# EAGLE design MM-Qwiic-Carrier-1x1 (EAGLE 9.5.2)
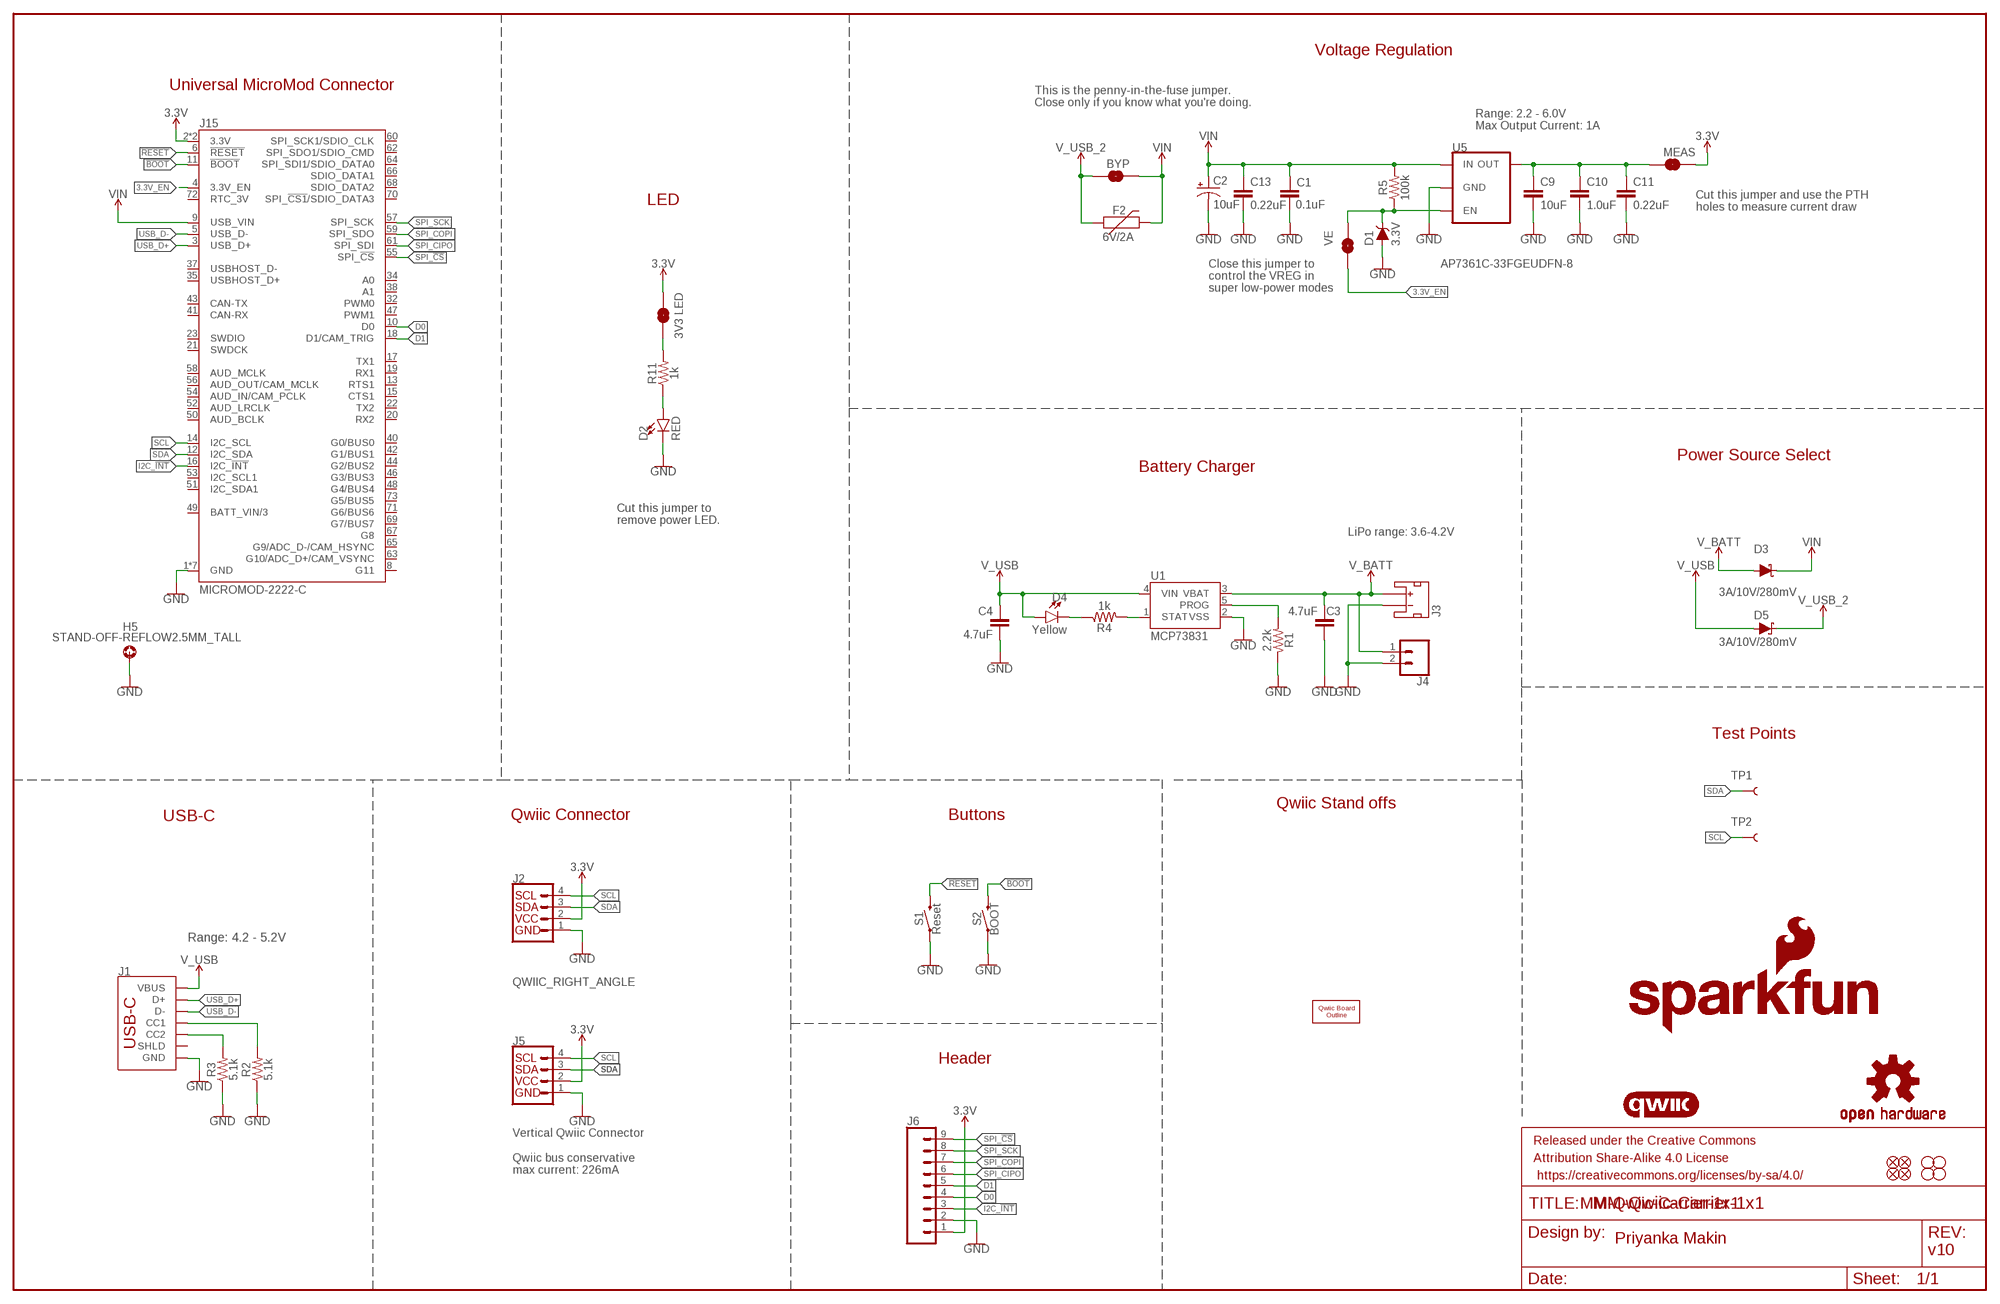
[diagram p0: schematic, sheet 1]

## Parts
BYP  JUMPER-SMT_2_NO_SILK  [SMT-JUMPER_2_NO_SILK]
C1  0.1uF  0.1UF-0603-25V-(+80/-20%)  [0603]
C2  10uF  10UF-POLAR-EIA3216-16V-10%(TANT)  [EIA3216]
C3  4.7uF  4.7UF-0603-35V-(20%)  [0603]
C4  4.7uF  4.7UF-0603-35V-(20%)  [0603]
C9  10uF  10UF-0603-6.3V-20%  [0603]
C10  1.0uF  1.0UF-0603-16V-10%  [0603]
C11  0.22uF  0.22UF-0603-25V-10%  [0603]
C13  0.22uF  0.22UF-0603-25V-10%  [0603]
D1  3.3V  DIODE-ZENER-MM3Z3V3T1G  [SOD-323]
D2  RED  LED-RED0603  [LED-0603]
D3  3A/10V/280mV  DIODE-SCHOTTKY-BAT60A  [SOD-323]
D4  Yellow  LED-YELLOW0603  [LED-0603]
D5  3A/10V/280mV  DIODE-SCHOTTKY-BAT60A  [SOD-323]
F2  6V/2A  PPTC_6V2A  [1210]
FD1  FIDUCIALUFIDUCIAL  [FIDUCIAL-MICRO]
FD2  FIDUCIALUFIDUCIAL  [FIDUCIAL-MICRO]
FD3  FIDUCIALUFIDUCIAL  [FIDUCIAL-MICRO]
FD4  FIDUCIALUFIDUCIAL  [FIDUCIAL-MICRO]
FRAME1  FRAME-LEDGER  [CREATIVE_COMMONS]
H1  STAND-OFF  [STAND-OFF]
H2  STAND-OFF  [STAND-OFF]
H3  STAND-OFF  [STAND-OFF]
H4  STAND-OFF  [STAND-OFF]
H5  STAND-OFF-REFLOW2.5MM_TALL  [STAND-OFF-REFLOW-M2.5]
J1  USB_C_2-LAYER_PADS  [USB-C-16P-2LAYER-PADS]
J2  QWIIC_RIGHT_ANGLE  QWIIC_CONNECTORJS-1MM  [JST04_1MM_RA]
J3  JST_2MM_MALE  [JST-2-SMD]
J4  CONN_021X02_NO_SILK  [1X02_NO_SILK]
J5  Vertical Qwiic Connector  QWIIC_CONNECTOR  [JST04_1MM_VERT]
J6  CONN_09NO_SILK  [1X09_NO_SILK]
J15  MICROMOD-2222-C  [M.2-CONNECTOR-E]
JP4  3V3 LED  JUMPER-SMT_2_NC_TRACE_SILK  [SMT-JUMPER_2_NC_TRACE_SILK]
JP6  VE  JUMPER-SMT_2_NO_SILK  [SMT-JUMPER_2_NO_SILK]
LOGO1  SFE_LOGO_NAME_FLAME.2_INCH  [SFE_LOGO_NAME_FLAME_.2]
LOGO2  QWIIC_LOGO_CONNECTOR  [QWIIC_5.5MM]
LOGO3  OSHW-LOGOM  [OSHW-LOGO-M]
MEAS  JUMPER-COMBO_2_NC_TRACE  [COMBO-JUMPER_2_NC_TRACE]
R1  2.2k  2.2KOHM-0603-1/10W-1%  [0603]
R2  5.1k  5.1KOHM5.1KOHM-0603-1/10W-1%  [0603]
R3  5.1k  5.1KOHM5.1KOHM-0603-1/10W-1%  [0603]
R4  1k  1KOHM-0603-1/10W-1%  [0603]
R5  100k  100KOHM-0603-1/10W-1%  [0603]
R11  1k  1KOHM-0603-1/10W-1%  [0603]
S1  Reset  MOMENTARY-SWITCH-SPST-SMD-5.2-TALL-REDUNDANT  [TACTILE_SWITCH_SMD_5.2MM]
S2  BOOT  MOMENTARY-SWITCH-SPST-SMD-5.2-TALL-REDUNDANT  [TACTILE_SWITCH_SMD_5.2MM]
TP1  TEST-POINT3X5  [PAD.03X.05]
TP2  TEST-POINT3X5  [PAD.03X.05]
U1  MCP73831  [SOT23-5]
U5  AP7361C-33FGEUDFN-8  [UDFN-8]
U$5  QWIIC_BOARD_OUTLINESTANDOFF  [QWIIC_BOARD_MOUNT_SMD_STANDOFFS]

## Nets
3.3V: J2.2 J5.2 J6.1 J15.2(3.3V) J15.74(3.3V) JP4.2 MEAS.2 MEAS.4
3.3V_EN: J15.4(3.3V_EN) JP6.1
!BOOT!: J15.11(!BOOT!) S2.3 S2.4
!RESET!: J15.6(!RESET!) S1.3 S1.4
D0: J6.4 J15.10(D0)
D1: J6.5 J15.18(D1/CAM_TRIG)
GND: C1.2 C2.- C3.2 C4.2 C9.2 C10.2 C11.2 C13.2 D1.A D2.C H5.1 J1.GND J1.GND2(GND) J2.1 J3.1(-) J4.2 J5.1 J6.2 J15.1(GND) J15.7(GND) J15.33(GND) J15.36(GND) J15.39(GND) J15.45(GND) J15.75(GND) R1.1 R2.1 R3.1 S1.1 S1.2 S2.1 S2.2 U1.2(VSS) U5.4(GND) U5.EP(GND)
I2C_!INT!: J6.3 J15.16(I2C_!INT!)
N$1: C9.1 C10.1 C11.1 MEAS.1 MEAS.3 U5.1(OUT)
N$2: R1.2 U1.5(PROG)
N$3: D4.C R4.1
N$4: JP4.1 R11.2
N$6: D2.A R11.1
N$8: R4.2 U1.1(STAT)
N$10: J1.A5(CC1) R2.2
N$11: J1.B5(CC2) R3.2
SCL: J2.4 J5.4 J15.14(I2C_SCL) TP2.P$1
SDA: J2.3 J5.3 J15.12(I2C_SDA) TP1.P$1
SPI_!CS!: J6.9 J15.55(SPI_!CS!)
SPI_CIPO: J6.6 J15.61(SPI_SDI)
SPI_COPI: J6.7 J15.59(SPI_SDO)
SPI_SCK: J6.8 J15.57(SPI_SCK)
USB_D+: J1.A6(D+) J1.B6(D+) J15.3(USB_D+)
USB_D-: J1.A7(D-) J1.B7(D-) J15.5(USB_D-)
V_BATT: C3.1 D3.A J3.2(+) J4.1 U1.3(VBAT)
V_USB: C4.1 D4.A D5.A J1.VBUS1(VBUS) J1.VBUS2(VBUS) U1.4(VIN)
V_USB_2: BYP.1 D5.C F2.1
VIN: BYP.2 C1.1 C2.+ C13.1 D3.C F2.2 J15.9(USB_VIN) R5.2 U5.8(IN)
VREG_EN: D1.C JP6.2 R5.1 U5.5(EN)
Unconnected: J1.SHLD1(SHLD) J1.SHLD2(SHLD) J1.SHLD3(SHLD) J1.SHLD4(SHLD) J3.NC1(PAD1) J3.NC2(PAD2) J15.8(G11) J15.13(RTS1) J15.15(CTS1) J15.17(TX1) J15.19(RX1) J15.20(RX2) J15.21(SWDCK) J15.22(TX2) J15.23(SWDIO) J15.32(PWM0) J15.34(A0) J15.35(USBHOST_D+) J15.37(USBHOST_D-) J15.38(A1) J15.40(G0/BUS0) J15.41(CAN-RX) J15.42(G1/BUS1) J15.43(CAN-TX) J15.44(G2/BUS2) J15.46(G3/BUS3) J15.47(PWM1) J15.48(G4/BUS4) J15.49(BATT_VIN/3) J15.50(AUD_BCLK) J15.51(I2C_SDA1) J15.52(AUD_LRCLK) J15.53(I2C_SCL1) J15.54(AUD_IN/CAM_PCLK) J15.56(AUD_OUT/CAM_MCLK) J15.58(AUD_MCLK) J15.60(SPI_SCK1/SDIO_CLK) J15.62(SPI_SDO1/SDIO_CMD) J15.63(G10/ADC_D+/CAM_VSYNC) J15.64(SPI_SDI1/SDIO_DATA0) J15.65(G9/ADC_D-/CAM_HSYNC) J15.66(SDIO_DATA1) J15.67(G8) J15.68(SDIO_DATA2) J15.69(G7/BUS7) J15.70(SPI_!CS1!/SDIO_DATA3) J15.71(G6/BUS6) J15.72(RTC_3V) J15.73(G5/BUS5)

## Notes on the sheet
- Voltage Regulation
- Universal MicroMod Connector
- This is the penny-in-the-fuse jumper.
  Close only if you know what you're doing.
- Range: 2.2 - 6.0V
  Max Output Current: 1A
- LED
- Cut this jumper and use the PTH 
  holes to measure current draw
- Close this jumper to 
  control the VREG in 
  super low-power modes
- Power Source Select
- Battery Charger
- Cut this jumper to
  remove power LED.
- LiPo range: 3.6-4.2V
- Test Points
- Qwiic Stand offs
- USB-C | Qwiic Connector | Buttons
- Range: 4.2 - 5.2V
- Header
- Qwiic bus conservative 
  max current: 226mA
- MM-Qwiic-Carrier-1x1
- Priyanka Makin
- v10

## Library data of the parts
BYP JP6 = SparkFun-Jumpers:JUMPER-SMT_2_NO: Normally open jumper This jumper has two pads in close proximity to each other. Apply solder to close the connection. Round pads are easier to solder for beginners, but are a lot larger. SparkFun Product that uses the round pads: SparkFun EL Sequencer <https://www.sparkfun.com/products/12781>
C1 = SparkFun-Capacitors:0.1UF: 0.1µF ceramic capacitors A capacitor is a passive two-terminal electrical component used to store electrical energy temporarily in an electric field.; PROD_ID: CAP-00810
C2 = SparkFun-Capacitors:10UF-POLAR: 10.0µF polarized capacitors A capacitor is a passive two-terminal electrical component used to store electrical energy temporarily in an electric field.; PROD_ID: CAP-00811
C3 C4 = SparkFun-Capacitors:4.7UF: 4.7µF ceramic capacitors A capacitor is a passive two-terminal electrical component used to store electrical energy temporarily in an electric field.; PROD_ID: CAP-14106
C9 = SparkFun-Capacitors:10UF: 10.0µF ceramic capacitors A capacitor is a passive two-terminal electrical component used to store electrical energy temporarily in an electric field.; PROD_ID: CAP-11015
C10 = SparkFun-Capacitors:1.0UF: 1µF ceramic capacitors A capacitor is a passive two-terminal electrical component used to store electrical energy temporarily in an electric field.; PROD_ID: CAP-00868
C11 C13 = SparkFun-Capacitors:0.22UF: 0.22µF ceramic capacitors A capacitor is a passive two-terminal electrical component used to store electrical energy temporarily in an electric field.; PROD_ID: CAP-07822
D1 = SparkFun-DiscreteSemi:DIODE-ZENER: Zener Diode A Zener diode allows current to flow from its anode to its cathode like a normal semiconductor diode, but it also permits current to flow in the reverse direction when its "Zener voltage" is reached. - WIkipedia; PROD_ID: DIO-11284
D2 = SparkFun-LED:LED-RED: Red SMD LED Used in manufacturing of most products at SparkFun Packages: 0603 - SMD 0603 package [Product Link] <http://docs.avagotech.com/docs/AV02-0551EN> 0603 SMART - SMD 0603 SMART package ( more efficient and expensive)[Product Link] <http://www.osram-os.com/Graphics/XPic2/00077099_0.pdf> 1206 - SMD1206 package [Product Link] <https://www.sparkfun.com/datasheets/DevTools/LilyPad/Q150OVS4.pdff> SparkFun Products: Pro Mini 328 -5V <https://www.sparkfun.com/products/821> RedBoard <https://www.sparkfun.com/products/12757> IOIO-OTG <https://www.sparkfun.com/products/13613>; PROD_ID: DIO-00819
D3 D5 = SparkFun-DiscreteSemi:DIODE-SCHOTTKY: Schottky diode A Schottky diode is a semiconductor diode which has a low forward voltage drop and a very fast switching action.; PROD_ID: DIO-14072
D4 = SparkFun-LED:LED-YELLOW: Yellow SMD LED Used in manufacturing several products at SparkFun. Packages: 0603 - SMD 0603 package[Product Link] <http://www.kingbrightusa.com/product.asp?catalog_name=LED&product_id=APT1608SYCK> 0603 -SMART - SMART SMD 0603 package (more efficient/more expensive) [Product Link] <http://www.osram-os.com/osram_os/en/products/product-catalog/led-light-emitting-diodes/smartled-0603/ly-l29k/index.jsp> LilyPad - SMD1206 package[Product Datasheet] <https://www.sparkfun.com/datasheets/DevTools/LilyPad/Q150YUS4.pdf> SparkFun Products: Blynk Board <https://www.sparkfun.com/products/13794> IOIO-OTG <https://www.sparkfun.com/products/13613> XBee Explorer Serial <https://www.sparkfun.com/products/13225>; PROD_ID: DIO-09003
F2 = SparkFun-Fuses:PPTC: Resettable Fuse PPTC Resettable Fuse. Really a sort of resistor with a polymeric positive temperature coefficient whose resistance increases dramatically with an increase in temperature. When heated by the power passing through the resistance rises causing the current to be limited, protecting the circuit. This is achieved by the transition of the polymer from a crystalline to an amorphous state where the conductive carbon separates breaking the conductive pathways found in the cool crystalline structure. When a PPTC cools back down it resumes conducting letting the circuit turn back on. SparkFun Products: SparkFun RedBoard - Programmed with Arduino <https://www.sparkfun.com/products/12757> Pro Micro - 5V/16MHz <https://www.sparkfun.com/products/12640> Arduino Pro 328 - 5V/16MHz <https://www.sparkfun.com/products/10915> MP3 Trigger <https://www.sparkfun.com/products/13720>; PROD_ID: RES-14313
FD1-FD4 = SparkFun-Aesthetics:FIDUCIAL: Fiducial Alignment Points Point-of-reference for pick-and-place machines and other optical instruments.
FRAME1 = SparkFun-Aesthetics:FRAME-LEDGER: Schematic Frame - Ledger Standard 11x14 US Ledger frame
H1-H4 = SparkFun-Hardware:STAND-OFF: Stand Off Drill holes for mechanically mounting via screws, standoffs, etc. Note: Use the keepout ring to avoid running the screw head into surrounding components. Variant Overviews STAND-OFF - Mechanical footprint for a #4 phillips button head screw. STAND-OFF-TIGHT - Mechanical footprint for a #4 phillips button head screw, Example SparkFun Products Screw - Phillips Head (1/4", 4-40, 10 pack) <https://www.sparkfun.com/products/10453> (PRT-10453) Screw - Phillips Head (1/2", 4-40, 10 pack) <https://www.sparkfun.com/products/10452> (PRT-10452) Screw - Phillips Head (3/4", 4-40, 10 pack) <https://www.sparkfun.com/products/10451> (PRT-10451) Screw - Phillips Head (1", 4-40, 10 pack) <https://www.sparkfun.com/products/10450> (PRT-10450)
H5 = SparkFun-Hardware:STAND-OFF-REFLOW: Stand Off Reflow Compatible A metal standoff that can be placed and reflowed onto a PCB.; PROD_ID: HW-14899
J1 = SparkFun-Connectors:USB_C: USB Type C 16Pin Connector Super Speed pins not available on the 16-pin purely SMD connector so this part is best for USB 2.0 implementations. D1 and D2 are tied together enabling D+/- no matter which way the cable is plugged into the connector. The two channel configuration pins (CC1/2) are exposed. These are normally connected to ground via 5.1k resistors but can be reconfigured for high current/high power applications. **4-LAYER BOARD WARNING!!** If designing 4-layer board, make sure to select the variant _4-LAYER-ISOLATED. The linked footprint (USB-C-16-4LAYER-ISOLATED) includes some very necessary cutout polygons in the inner layers (2 and 15). This prevents the PTH mounting shield legs on the USB connector from electrically connecting any other polygons on the inner layers (usually VCC and GND).; PROD_ID: CONN-14122
J2 = SparkFun-Connectors:QWIIC_CONNECTOR: SparkFun I2C Standard Qwiic Connector An SMD 1mm pitch JST connector makes it easy and quick (get it? Qwiic?) to connect I2C devices to each other. The Qwiic system <http://www.sparkfun.com/qwiic> enables fast and solderless connection between popular platforms and various sensors and actuators. We carry 200mm <https://www.sparkfun.com/products/14204>, 100mm <https://www.sparkfun.com/products/14205>, 50mm <https://www.sparkfun.com/products/14206>, and breadboard friendly <https://www.sparkfun.com/products/14207> Qwiic cables. We also offer 10 pcs strips <https://www.sparkfun.com/products/14323> the SMD connectors.; PROD_ID: CONN-13694
J3 = SparkFun-Connectors:JST_2MM_MALE: JST 2MM MALE RA CONNECTOR Two pin, compact surface mount connector. Commonly used as a battery input connection point. We really like the solid locking feeling and high current rating on these small connectors. We use these all the time as battery connectors. Mates to single-cell LiPo batteries. Here is the connector we sell at SparkFun: JST Right Angle Connector - White <https://www.sparkfun.com/products/8612> (PRT-08612) Datasheet <http://www.sparkfun.com/datasheets/Prototyping/Connectors/JST-Horizontal.pdf> It was used on these SparkFun products: SparkFun MOSFET Power Controller <https://www.sparkfun.com/products/11214> (PRT-11214) SparkFun Battery Babysitter - LiPo Battery Manager <https://www.sparkfun.com/products/13777> (PRT-13777) And many, many others that required a lipo battery connection.; PROD_ID: CONN-11443; SF_ID: PRT-08612
J4 = SparkFun-Connectors:CONN_02: Multi connection point. Often used as Generic Header-pin footprint for 0.1 inch spaced/style header connections On any of the 0.1 inch spaced packages, you can populate with these: Break Away Headers - Straight <https://www.sparkfun.com/products/116> (PRT-00116) Break Away Male Headers - Right Angle <https://www.sparkfun.com/products/553> (PRT-00553) Female Headers <https://www.sparkfun.com/products/115> (PRT-00115) Break Away Headers - Machine Pin <https://www.sparkfun.com/products/117> (PRT-00117) Break Away Female Headers - Swiss Machine Pin <https://www.sparkfun.com/products/743> (PRT-00743) For SCREWTERMINALS and SPRING TERMINALS visit here: Screw Terimnals on SparkFun.com <https://www.sparkfun.com/search/results?term=Screw+Terminals> (5mm/3.5mm/2.54mm spacing) This device is also useful as a general connection point to wire up your design to another part of your project. Our various solder wires solder well into these plated through hole pads. Hook-Up Wire - Assortment (Stranded, 22 AWG) <https://www.sparkfun.com/products/11375> (PRT-11375) Hook-Up Wire - Assortment (Solid Core, 22 AWG) <https://www.sparkfun.com/products/11367> (PRT-11367) View the entire wire category on our website here <https://www.sparkfun.com/categories/141> Special notes: Molex polarized connector foot print use with: PRT-08233 with associated crimp pins and housings. 2.54_SCREWTERM for use with PRT-10571. 3.5mm Screw Terminal footprints for PRT-08084 5mm Screw Terminal footprints for use with PRT-08432
J5 = SparkFun-Connectors:QWIIC_CONNECTOR: SparkFun I2C Standard Qwiic Connector An SMD 1mm pitch JST connector makes it easy and quick (get it? Qwiic?) to connect I2C devices to each other. The Qwiic system <http://www.sparkfun.com/qwiic> enables fast and solderless connection between popular platforms and various sensors and actuators. We carry 200mm <https://www.sparkfun.com/products/14204>, 100mm <https://www.sparkfun.com/products/14205>, 50mm <https://www.sparkfun.com/products/14206>, and breadboard friendly <https://www.sparkfun.com/products/14207> Qwiic cables. We also offer 10 pcs strips <https://www.sparkfun.com/products/14323> the SMD connectors.; PROD_ID: CONN-14483
J6 = SparkFun-Connectors:CONN_09: Multi connection point. Often used as Generic Header-pin footprint for 0.1 inch spaced/style header connections On any of the 0.1 inch spaced packages, you can populate with these: Break Away Headers - Straight <https://www.sparkfun.com/products/116> (PRT-00116) Break Away Male Headers - Right Angle <https://www.sparkfun.com/products/553> (PRT-00553) Female Headers <https://www.sparkfun.com/products/115> (PRT-00115) Break Away Headers - Machine Pin <https://www.sparkfun.com/products/117> (PRT-00117) Break Away Female Headers - Swiss Machine Pin <https://www.sparkfun.com/products/743> (PRT-00743) For SCREWTERMINALS and SPRING TERMINALS visit here: Screw Terimnals on SparkFun.com <https://www.sparkfun.com/search/results?term=Screw+Terminals> (5mm/3.5mm/2.54mm spacing) This device is also useful as a general connection point to wire up your design to another part of your project. Our various solder wires solder well into these plated through hole pads. Hook-Up Wire - Assortment (Stranded, 22 AWG) <https://www.sparkfun.com/products/11375> (PRT-11375) Hook-Up Wire - Assortment (Solid Core, 22 AWG) <https://www.sparkfun.com/products/11367> (PRT-11367) View the entire wire category on our website here <https://www.sparkfun.com/categories/141> Special notes: Molex polarized connector foot print use with SKU : PRT-08231 with associated crimp pins and housings. 1MM SMD Version SKU: PRT-10208 NOTES ON THE VARIANTS LOCK and LOCK_LONGPADS... This footprint was designed to help hold the alignment of a through-hole component (i.e. 6-pin header) while soldering it into place. You may notice that each hole has been shifted either up or down by 0.005 of an inch from it's more standard position (which is a perfectly straight line). This slight alteration caused the pins (the squares in the middle) to touch the edges of the holes. Because they are alternating, it causes a "brace" to hold the component in place. 0.005 has proven to be the perfect amount of "off-center" position when using our standard breakaway headers. Although looks a little odd when you look at the bare footprint, once you have a header in there, the alteration is very hard to notice. Also,if you push a header all the way into place, it is covered up entirely on the bottom side.
J15 = SparkFun-MicroMod:MICROMOD: MicroMod Connector Description: A card edge connector and mating PCB connector to allow various MicroMod Processor Boards to be coupled with various carrier boards of different capabilities. Based on the M.2 standard.; PROD_ID: CONN-14877
JP4 = SparkFun-Jumpers:JUMPER-SMT_2_NC_TRACE: Normally closed trace jumper This jumper has a trace between two pads so it's normally closed (NC). Use a razor knife to open the connection. For best results follow the IPC guidelines for cutting traces: Cutout at least 0.063 mm (0.005 in). Remove all loose material to clean up the cut area. Seal the cut with an approved epoxy. Reapply solder to reclose the connection.
LOGO1 = SparkFun-Aesthetics:SFE_LOGO_NAME_FLAME: SparkFun Font Logo w/ Flame This is the SparkFun full logo. The logo on the schematic will always be the same size; the package variant is the height of the flame part of the logo. Default layer for the logo on the board is tSilk.
LOGO2 = SparkFun-Aesthetics:QWIIC_LOGO: Qwiic Logos for placement on schematic and PCB. The 5.5mm silk logo is best for placing next to Qwiic connector.
LOGO3 = SparkFun-Aesthetics:OSHW-LOGO: Open-Source Hardware (OSHW) Logo This logo indicates the piece of hardware it is found on incorporates a OSHW license and/or adheres to the definition of open source hardware found here: http://freedomdefined.org/OSHW
MEAS = SparkFun-Jumpers:JUMPER-COMBO_2_NC_TRACE
R1 = SparkFun-Resistors:2.2KOHM: 2.2kΩ resistor A resistor is a passive two-terminal electrical component that implements electrical resistance as a circuit element. Resistors act to reduce current flow, and, at the same time, act to lower voltage levels within circuits. - Wikipedia; PROD_ID: RES-08272
R2 R3 = SparkFun-Resistors:5.1KOHM; PROD_ID: RES-12083
R4 R11 = SparkFun-Resistors:1KOHM: 1kΩ resistor A resistor is a passive two-terminal electrical component that implements electrical resistance as a circuit element. Resistors act to reduce current flow, and, at the same time, act to lower voltage levels within circuits. - Wikipedia; PROD_ID: RES-07856
R5 = SparkFun-Resistors:100KOHM: 100kΩ resistor A resistor is a passive two-terminal electrical component that implements electrical resistance as a circuit element. Resistors act to reduce current flow, and, at the same time, act to lower voltage levels within circuits. - Wikipedia; PROD_ID: RES-07828
S1 S2 = SparkFun-Switches:MOMENTARY-SWITCH-SPST: Momentary Switch (Pushbutton) - SPST Normally-open (NO) SPST momentary switches (buttons, pushbuttons). Variants PTH-12MM - 12mm square, through-hole Momentary Pushbutton Switch - 12mm Square <https://www.sparkfun.com/products/9190> (COM-09190) PTH-6.0MM, PTH-6.0MM-KIT - 6.0mm square, through-hole Mini Pushbutton Switch <https://www.sparkfun.com/products/97> (COM-00097) KIT package intended for soldering kit's - only one side of pads' copper is exposed. PTH-RIGHT-ANGLE-KIT - Right-angle, through-hole Right Angle Tactile Button <https://www.sparkfun.com/products/10791> - Used on SparkFun BigTime Watch Kit <https://www.sparkfun.com/products/11734> SMD-12MM - 12mm square, surface-mount Tactile Button - SMD (12mm) <https://www.sparkfun.com/products/12993> (COM-12993) Used on SparkFun PicoBoard <https://www.sparkfun.com/products/11888> SMD-4.5MM - 4.5mm Square Trackball Switch Used on SparkFun Blackberry Trackballer Breakout <https://www.sparkfun.com/products/13169> SMD-4.6MMX2.8MM - 4.60mm x 2.80mm, surface mount Used on SparkFun SAMD21 Mini Breakout <https://www.sparkfun.com/products/13664> SMD-5.2MM, SMD-5.2-REDUNDANT - 5.2mm square, surface-mount Mini Pushbutton Switch - SMD <https://www.sparkfun.com/products/8720> (COM-08720) Used on Arduino Pro Mini <https://www.sparkfun.com/products/11114> REDUNDANT package connects both switch circuits together SMD-6.0X3.5MM - 6.0 x 3.5mm, surface mount Momentary Reset Switch SMD <https://www.sparkfun.com/products/8229> (COM-08229) SMD-6.2MM-TALL - 6.2mm square, surface mount Tactile Button - SMD (6mm) <https://www.sparkfun.com/products/12992> Used on SparkFun Digital Sandbox <https://www.sparkfun.com/products/12651> SMD-RIGHT-ANGLE - Right-angle, surface mount Used on SparkFun Block for Intel® Edison - Arduino <https://www.sparkfun.com/products/13036>; PROD_ID: SWCH-14139
TP1 TP2 = SparkFun-Connectors:TEST-POINT: SparkFun Test Points Bare copper test points for troubleshooting or In-Circuit-Testing. These are used by our Production team for verifying production board runs using pogo-pins on test beds. SparkFun Products: SparkFun LSM9DS1 Breakout <https://www.sparkfun.com/products/13284> SparkFun PSOC <https://www.sparkfun.com/products/13714> SparkFun Load Cell Amplifier <https://www.sparkfun.com/products/13879>
U1 = SparkFun-IC-Power:MCP73831: MCP73831T Li-Ion, Li-Pol Controller Miniature single cell, fully integrated Li-Ion, Li-polymer charge management controller Datasheet <http://ww1.microchip.com/downloads/en/DeviceDoc/20001984g.pdf> SparkFun Products: SparkFun ESP32 Thing <https://www.sparkfun.com/products/13907> SparkFun 9DoF Razor IMU M0 <https://www.sparkfun.com/products/14001>; PROD_ID: IC-09995
U5 = SparkFun-IC-Power:AP7361C-33FGE: AP7361C 3.3V LDO Regulator; PROD_ID: VREG-14094
U$5 = SparkFun-Boards:QWIIC_BOARD_OUTLINE: Standard Outline of a Qwiic Board. Good for defining a spot on shields and board areas in which to mount a Qwiic Board.

## Net classes
0 default: width 0 mm, drill 0 mm
1 power: width 0.762 mm

## Board
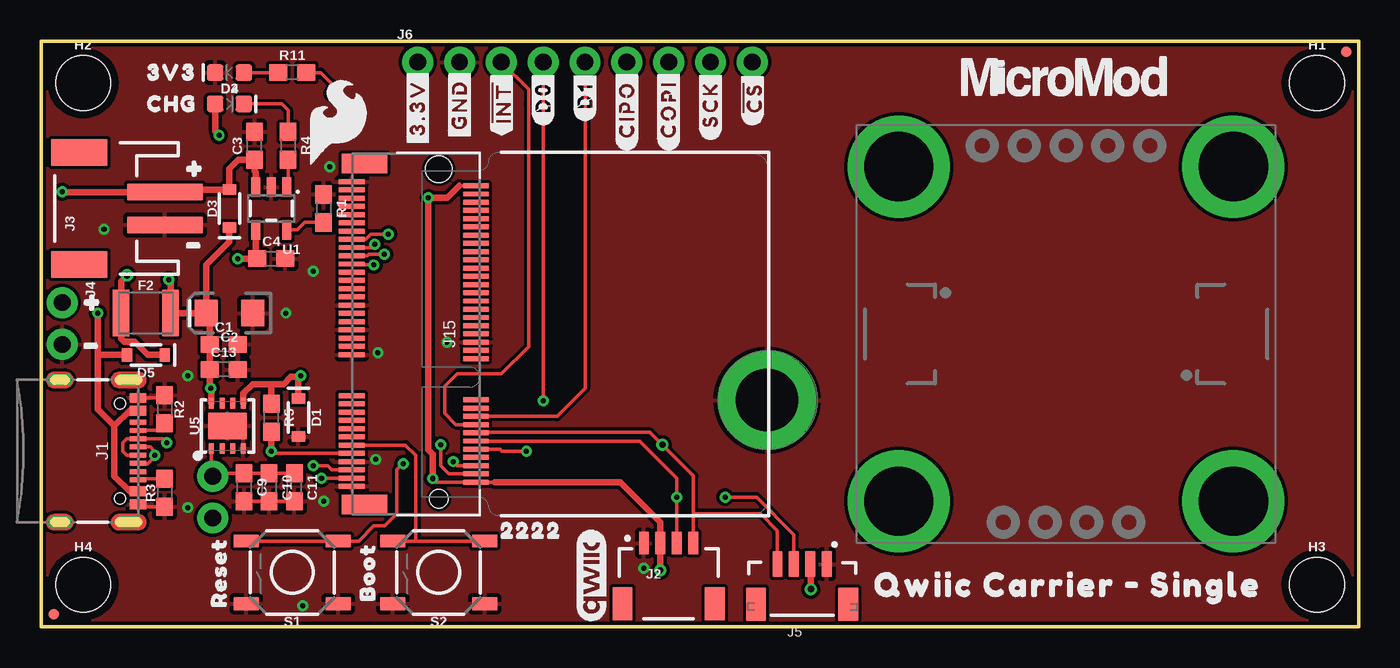
[diagram p1: board, top side]
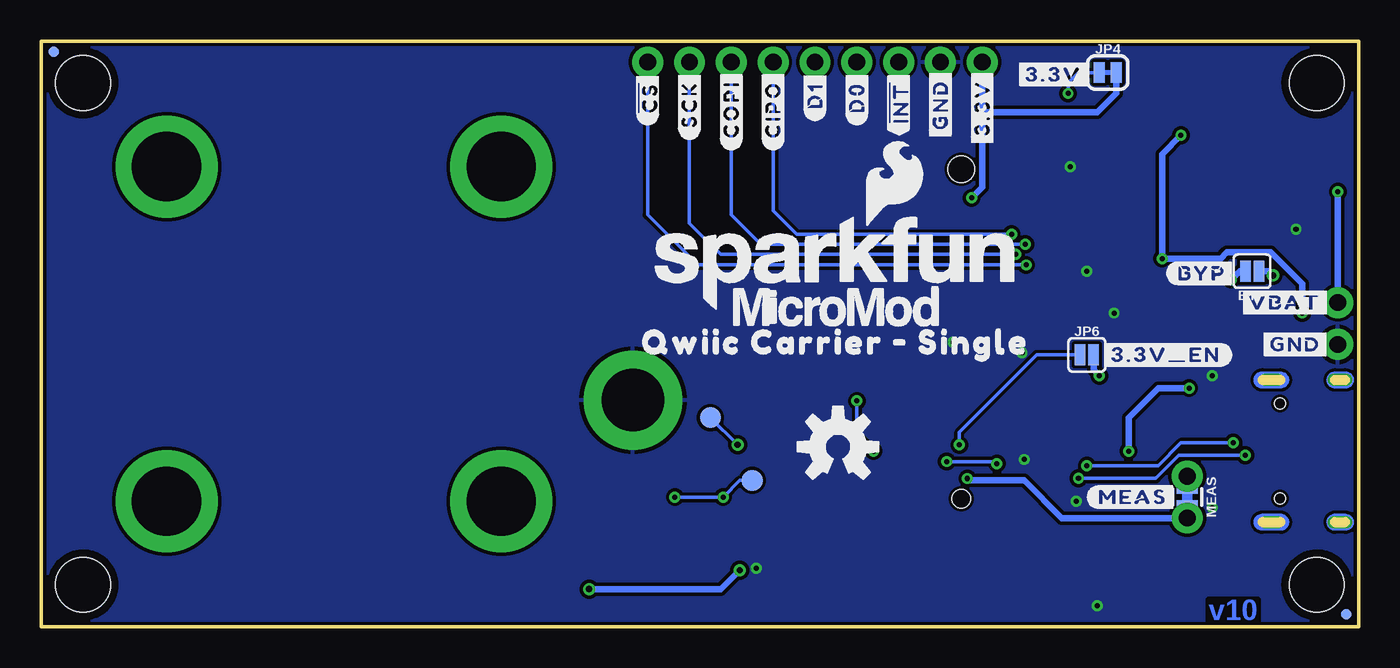
[diagram p2: board, bottom side, seen from below]

Size 80.01 x 35.56 mm. Coordinates in mm from the lower left corner, seen from the top.
Outline: 0,0 0,35.56 80.01,35.56 80.01,0 0,0
Copper layers (1*16): Top 0.035mm / dielectric 1.5mm / Bottom 0.035mm
Design rules "SparkFun-2-layer-TIGHT *": minimum track width 7mil, minimum drill 12mil, track to track 7mil, track to pad 7mil, pad to pad 7mil, via to via 7mil, smd to smd 7mil, copper to edge 7mil, drill to drill 7mil, minimum pad ring 7mil, minimum via ring 7mil, stop-mask expansion 4mil, vias tented up to drill 25mil, thermal gap 10mil

### Footprints (pad centres in the part's own frame; a part is rotated, then mirrored left to right if it is on the bottom)
SMT-JUMPER_2_NO_SILK = smd 0.635 x 1.27: 1 -0.406,0; 2 0.406,0
0603 = smd 1.1 x 1: 1 -0.85,0; 2 0.85,0
EIA3216 = smd 1.4 x 1.6: + 1.4,0; - -1.4,0
SOD-323 = smd 0.63 x 0.83: A 1.15,0; C -1.15,0
LED-0603 = smd 1 x 1: A -0.877,0; C 0.877,0
1210 = smd 1 x 2.8: 1 -1.5,0; 2 1.5,0
FIDUCIAL-MICRO = smd 0.635 x 0.635: 1 0,0
STAND-OFF = hole 3.302: 0,0
STAND-OFF-REFLOW-M2.5 = drill 3.8 pad 6: 1 0,0
USB-C-16P-2LAYER-PADS = smd 0.3 x 1: A5 -1.25,-0.34; A6 -0.25,-0.34; A7 0.25,-0.34; A8 1.25,-0.34; B5 1.75,-0.34; B6 0.75,-0.34; B7 -0.75,-0.34; B8 -1.75,-0.34 | smd 0.6 x 1: GND -3.225,-0.34; GND2 3.225,-0.34; VBUS1 -2.45,-0.34; VBUS2 2.45,-0.34 | drill 0.4 pad 0.6 long: SHLD1 -4.318,-0.915; SHLD2 4.318,-0.915; SHLD3 -4.318,-5.095; SHLD4 4.318,-5.095 | hole 0.65: -2.89,-1.445; 2.89,-1.445
JST04_1MM_RA = smd 0.6 x 1.35: 1 -1.5,0; 2 -0.5,0; 3 0.5,0; 4 1.5,0 | smd 1.2 x 2: NC1 2.8,-3.675; NC2 -2.8,-3.675
JST-2-SMD = smd 1 x 4.6: 1 -1,-3.7; 2 1,-3.7 | smd 1.6 x 3.4: NC1 -3.4,1.5; NC2 3.4,1.5
1X02_NO_SILK = drill 1.016 pad 1.88: 1 0,0; 2 2.54,0
JST04_1MM_VERT = smd 0.6 x 1.55: 1 -1.478,0.775; 2 -0.478,0.775; 3 0.522,0.775; 4 1.522,0.775 | smd 1.2 x 2: NC1 -2.778,3.2; NC2 2.822,3.2
1X09_NO_SILK = drill 1.016 pad 1.88: 1 0,0; 2 2.54,0; 3 5.08,0; 4 7.62,0; 5 10.16,0; 6 12.7,0; 7 15.24,0; 8 17.78,0; 9 20.32,0
M.2-CONNECTOR-E = smd 0.3 x 1.55: 1 9.25,-5.275; 2 9,2.275; 3 8.75,-5.275; 4 8.5,2.275; 5 8.25,-5.275; 6 8,2.275; 7 7.75,-5.275; 8 7.5,2.275; 9 7.25,-5.275; 10 7,2.275; 11 6.75,-5.275; 12 6.5,2.275; 13 6.25,-5.275; 14 6,2.275; 15 5.75,-5.275; 16 5.5,2.275; 17 5.25,-5.275; 18 5,2.275; 19 4.75,-5.275; 20 4.5,2.275; 21 4.25,-5.275; 22 4,2.275; 23 3.75,-5.275; 32 1.5,2.275; 33 1.25,-5.275; 34 1,2.275; 35 0.75,-5.275; 36 0.5,2.275; 37 0.25,-5.275; 38 0,2.275; 39 -0.25,-5.275; 40 -0.5,2.275; 41 -0.75,-5.275; 42 -1,2.275; 43 -1.25,-5.275; 44 -1.5,2.275; 45 -1.75,-5.275; 46 -2,2.275; 47 -2.25,-5.275; 48 -2.5,2.275; 49 -2.75,-5.275; 50 -3,2.275; 51 -3.25,-5.275; 52 -3.5,2.275; 53 -3.75,-5.275; 54 -4,2.275; 55 -4.25,-5.275; 56 -4.5,2.275; 57 -4.75,-5.275; 58 -5,2.275; 59 -5.25,-5.275; 60 -5.5,2.275; 61 -5.75,-5.275; 62 -6,2.275; 63 -6.25,-5.275; 64 -6.5,2.275; 65 -6.75,-5.275; 66 -7,2.275; 67 -7.25,-5.275; 68 -7.5,2.275; 69 -7.75,-5.275; 70 -8,2.275; 71 -8.25,-5.275; 72 -8.5,2.275; 73 -8.75,-5.275; 74 -9,2.275; 75 -9.25,-5.275 | smd 1.2 x 2.75: A1 10.35,-4.5; A2 -10.35,-4.5 | hole 1.1: 10,0 | hole 1.6: -10,0
SMT-JUMPER_2_NC_TRACE_SILK = smd 0.66 x 1.27: 1 -0.521,0; 2 0.521,0
COMBO-JUMPER_2_NC_TRACE = smd 0.635 x 1.27: 1 -0.508,0; 2 0.508,0 | drill 1.016 pad 1.88: 3 -1.27,0; 4 1.27,0
TACTILE_SWITCH_SMD_5.2MM = smd 1.524 x 0.762: 1 -2.794,1.905; 2 2.794,1.905; 3 -2.794,-1.905; 4 2.794,-1.905
PAD.03X.05 = smd 1.27 x 1.27: P$1 0,0
SOT23-5 = smd 0.55 x 1.2: 1 -0.95,-1.3; 2 0,-1.3; 3 0.95,-1.3; 4 0.95,1.3; 5 -0.95,1.3
UDFN-8 = smd 0.3 x 0.65: 1 -0.975,-1.375; 2 -0.325,-1.375; 3 0.325,-1.375; 4 0.975,-1.375; 5 0.975,1.375; 6 0.325,1.375; 7 -0.325,1.375; 8 -0.975,1.375 | smd 2.35 x 1.6: EP 0,0
QWIIC_BOARD_MOUNT_SMD_STANDOFFS = drill 4.216 pad 6.198: 1 -10.16,10.16; 2 10.16,10.16; 3 -10.16,-10.16; 4 10.16,-10.16

### Placement (x,y rotation side)
BYP  6.48,21.59 180 bottom
C1  11.09,17.14 0 top
C2  11.43,19.05 180 top
C3  12.95,29.21 90 top
C4  13.97,22.35 0 top
C9  12.32,8.47 270 top
C10  13.84,8.47 270 top
C11  15.37,8.47 270 top
C13  11.09,15.62 0 top
D1  15.62,12.7 270 top
D2  11.43,33.66 180 top
D3  11.43,25.4 90 top
D4  11.43,31.75 0 top
D5  6.35,16.51 180 top
F2  6.35,19.05 0 top
FD1  0.76,0.76 0 top
FD2  79.25,34.92 0 top
FD3  0.76,0.76 0 bottom
FD4  79.25,34.92 0 bottom
FRAME1  8.89,-21.59 0 top  (outside the outline)
H1  77.47,33.02 0 top
H2  2.54,33.02 0 top
H3  77.47,2.54 0 top
H4  2.54,2.54 0 top
H5  44.07,13.76 0 top
J1  6.22,10.67 270 top
J2  38.1,5.08 0 top
J3  3.81,25.4 90 top
J4  1.27,19.68 270 top
J5  46.23,4.57 180 top
J6  22.86,34.29 0 top
J15  24.13,17.78 270 top
JP4  15.24,33.66 0 bottom
JP6  16.51,16.51 0 bottom
LOGO1  31.75,22.1 0 bottom
LOGO2  33.4,3.11 90 top
LOGO3  31.62,10.92 0 bottom
MEAS  10.41,7.87 270 bottom
R1  17.14,25.4 270 top
R2  7.49,13.21 270 top
R3  7.49,8.13 90 top
R4  14.99,29.21 270 top
R5  13.97,12.7 270 top
R11  15.24,33.66 0 top
S1  15.24,3.3 180 top
S2  24.13,3.3 180 top
TP1  36.83,8.89 0 bottom
TP2  39.37,12.7 0 bottom
U1  13.97,25.4 180 top
U5  11.3,12.19 0 top
U$1  [#3#3V_EN#0]  15.75,16.51 0 bottom
U$2  [QWIIC_CARRIER_#_SINGLE0]  49.53,2.54 0 top
U$3  [3V30]  5.71,33.66 0 top
U$4  [CHG0]  5.71,31.75 0 top
U$5  62.23,17.78 0 top
U$6  [#3#3V#0]  20.95,33.53 0 bottom
U$7  [#BYP#0]  11.68,21.46 0 bottom
U$8  [#GND#0]  25.4,29.46 90 top
U$9  [#MEAS#0]  16.51,7.87 0 bottom
U$11  [#0]  1.52,19.68 0 top
U$12  [#VBAT#0]  7.37,19.68 0 bottom
U$14  [#GND#0]  25.4,29.46 90 bottom
U$15  [##INT##0]  27.94,29.84 90 top
U$16  [##INT##0]  27.94,29.84 90 bottom
U$17  [#D0#0]  30.48,30.48 90 top
U$18  [#D0#0]  30.48,30.48 90 bottom
U$19  [QWIIC_CARRIER_#_SINGLE0]  44.58,17.27 0 bottom
U$20  [#D1#0]  33.02,30.73 90 top
U$21  [#D1#0]  33.02,30.73 90 bottom
U$22  [#CIPO#0]  35.56,28.96 90 top
U$23  [#CIPO#0]  35.56,28.96 90 bottom
U$24  [#COPI#0]  38.1,28.96 90 top
U$25  [#COPI#0]  38.1,28.96 90 bottom
U$26  [#SCK#0]  40.64,29.59 90 top
U$27  [#SCK#0]  40.64,29.59 90 bottom
U$28  [##CS##0]  43.18,30.48 90 top
U$29  [##CS##0]  43.18,30.48 90 bottom
U$30  [RESET0]  10.79,0.51 90 top
U$31  [BOOT0]  19.81,0.89 90 top
U$32  [#0]  7.75,27.81 0 top
U$33  [#GND#0]  6.1,17.14 0 bottom
U$34  [22220]  27.18,5.84 0 top
U$35  [#3#3V#0]  22.86,29.08 90 top
U$36  [#0]  1.14,17.4 0 top
U$37  [#0]  7.37,23.5 0 top
U$38  [#3#3V#0]  22.86,29.08 90 bottom
U$44  [SFE_LOGO_FLAME_.2]  18.03,30.61 0 top
U$67  [MICROMOD_LOGO_.5]  62.1,33.4 0 top
U$68  [MICROMOD_LOGO_.5]  31.75,19.43 0 bottom

### Tracks (layer width: path | path; a pad name or v marks a point on that pad's centre or on a via)
3.3V  (via drill 0.3, 0.38)
  Top 0.203: v23.76,9 23.99,8.78 J15.2 27.54,8.78 | J15.74 25.38,26.78
  Top 0.406: v23.76,9 23.76,10.48 23.51,10.74 v23.51,26.05 24.65,26.05 25.38,26.78 | v37.59,3.43 v37.6,3.44 J2.2 37.6,6.34 35.16,8.78 27.54,8.78 | v46.74,2.29 46.74,3.77 J5.2
  Bottom 0.203: MEAS.2 MEAS.4 | v23.76,9 23.65,8.89
  Bottom 0.406: MEAS.4 18.03,6.6 20.32,8.89 23.65,8.89 | JP4.2 14.72,32.4 15.88,31.24 22.86,31.24 | v37.59,3.43 38.73,2.29 v46.74,2.29 | J6.1 22.86,31.24 | 22.86,31.24 22.86,26.7 v23.51,26.05
3.3V_EN  (via drill 0.3)
  Top 0.203: J15.4 24.76,9.28 24.26,9.78 v24.26,11.05
  Bottom 0.203: v24.26,11.05 24.26,11.81 19.56,16.51 JP6.1
!BOOT!
  Top 0.203: S2.4 22.73,5.21 | 22.73,5.21 S2.3 | 22.73,5.21 22.73,10.41 22.12,11.03 J15.11
!RESET!  (via drill 0.3)
  Top 0.203: v25.02,10.03 v25.02,10.02 25.26,9.78 J15.6 | v21.97,9.91 21.59,9.53 21.59,6.86 20.85,6.12 20.2,6.12 19.29,5.21 S1.3 S1.4
  Bottom 0.203: v21.97,9.91 22.1,10.03 v25.02,10.03
D0  (via drill 0.3)
  Top 0.203: v29.46,10.67 27.97,10.67 27.86,10.78 J15.10 | J6.4 v30.48,13.72
  Bottom 0.203: v30.48,13.72 30.48,11.68 v29.46,10.67
D1
  Top 0.203: J15.18 31.32,12.78 32.77,14.22 33.02,14.48 J6.5
GND  (via drill 0.3)
  Top 0.203: J1.GND 7.33,13.89 R2.1 | J1.GND2 6.05,7.28 R3.1 | C9.2 C10.2 C11.2
  other vias: 17.53,27.94 3.81,24.13 16.51,21.59 14.86,19.05 8.89,15.24 8.89,7.24 15.88,1.27 17.14,7.62 20.32,10.16 36.58,3.56 20.45,16.64 24.64,17.27
  pour Top (isolate 0.203): 0,35.56 0,0 80.01,0 80.01,35.56
  pour Bottom (isolate 0.203): 0,35.56 0,0 80.01,0 80.01,35.56
I2C_!INT!
  Top 0.203: J15.16 25.18,12.28 24.51,12.95 24.51,14.61 25.27,15.37 27.94,15.37 29.59,17.02 29.59,31.75 29.59,32.64 J6.3
N$1
  Top 0.203: C11.1 C10.1 C9.1 11.3,9.32 11.13,9.14 MEAS.3 10.33,9.23 U5.1
  Bottom 0.203: MEAS.1 MEAS.3
N$2
  Top 0.203: U1.5 15.55,24.1 16,24.55 R1.2
N$3
  Top 0.203: D4.C 14.61,31.75 14.99,31.37 R4.1
N$4  (via drill 0.3)
  Top 0.203: v17.65,32.38 17.65,32.98 16.98,33.66 R11.2
  Bottom 0.203: v17.65,32.38 17.65,33.03 17.03,33.66 JP4.1
N$6
  Top 0.203: D2.A R11.1
N$8
  Top 0.203: U1.1 14.99,26.77 R4.2
N$10
  Top 0.203: J1.A5 7.05,11.92 R2.2
N$11
  Top 0.203: J1.B5 5.94,8.98 R3.2
SCL  (via drill 0.38)
  Top 0.203: J2.4 39.6,6.86 | 39.6,6.86 39.6,9.17 v37.72,11.05 36.96,11.81 26.44,11.81 J15.14 | J5.4 44.71,5.84 43.69,6.86 39.6,6.86
  Bottom 0.203: TP2.P$1 v37.72,11.05
SDA  (via drill 0.3)
  Top 0.203: J2.3 v38.6,7.87 38.6,9.03 36.34,11.28 J15.12 | J5.3 45.71,5.6 43.43,7.87 v41.53,7.87
  Bottom 0.203: v41.53,7.87 v38.6,7.87 37.58,8.89 TP1.P$1
SPI_!CS!  (via drill 0.3)
  Top 0.203: v20.19,21.97 18.91,21.97 J15.55
  Bottom 0.203: v20.19,21.97 40.13,21.97 43.18,25.02 J6.9
SPI_CIPO  (via drill 0.3)
  Top 0.203: J15.61 19.69,23.53 20,23.84 v21.08,23.84
  Bottom 0.203: v21.08,23.84 34.12,23.84 35.56,25.27 J6.6
SPI_COPI  (via drill 0.3)
  Top 0.203: v20.25,23.23 20.05,23.03 J15.59
  Bottom 0.203: v20.25,23.23 36.31,23.23 38.1,25.02 J6.7
SPI_SCK  (via drill 0.3)
  Top 0.203: v20.83,22.62 19.89,22.62 19.8,22.53 J15.57
  Bottom 0.203: v20.83,22.62 20.83,22.61 38.73,22.61 40.64,24.51 J6.8
USB_D+  (via drill 0.3)
  Top 0.203: J1.A6 6.61,10.92 6.86,10.67 6.86,10.45 v6.89,10.41 6.89,10.32 6.48,9.91 5.89,9.91 J1.B6 | J15.3 v17.03,9.03 v17.02,9.02
  Bottom 0.203: v17.02,9.02 12.32,9.02 10.92,10.41 v6.89,10.41
USB_D-  (via drill 0.3)
  Top 0.203: J1.A7 5.2,10.42 4.95,10.67 4.95,11.18 5.2,11.42 J1.B7 7.38,11.42 v7.62,11.17 | J15.5 17.65,9.53 17.4,9.78 v16.51,9.78
  Bottom 0.203: v7.62,11.17 10.79,11.17 12.19,9.78 v16.51,9.78
V_BATT  (via drill 0.3)
  Top 0.406: U1.3 13.02,27.59 12.95,27.66 C3.1 11.98,28.36 11.43,27.81 D3.A 7.66,26.55 J3.2 1.29,26.4 v1.27,26.42
  Bottom 0.406: v1.27,26.42 J4.1
V_USB  (via drill 0.3)
  Top 0.406: J1.VBUS2 5.37,8.22 4.45,9.14 4.45,12.19 | J1.VBUS1 5.37,13.12 4.45,12.19 | 4.45,12.19 3.43,13.21 3.43,16.51 | v3.43,19.05 3.43,16.51 | v11.94,22.35 C4.1 13.02,22.45 U1.4 | D4.A 10.55,30.09 v10.79,29.84 | D5.A 3.43,16.51
  Bottom 0.406: v3.43,19.05 3.43,20.83 5.33,22.73 8,22.73 8.38,22.35 v11.94,22.35 11.94,28.7 v10.79,29.84
V_USB_2  (via drill 0.38)
  Top 0.406: D5.C 6.47,16.51 5.67,17.31 5.05,17.31 4.85,17.5 F2.1 4.85,20.98 v5.21,21.34
  Bottom 0.406: v5.21,21.34 5.46,21.59 BYP.1
VIN  (via drill 0.3)
  Top 0.203: v13.97,10.67 13.97,10.66 14.1,10.53 J15.9
  Top 0.406: C2.+ F2.2 7.85,20.98 v7.75,21.08 | C2.+ 10.24,18.84 C1.1 C13.1 10.24,14.55 v10.3,14.49 10.33,14.46 U5.8 | R5.2 v13.97,10.67 | D3.C 11.43,23.37 10.03,21.97 C2.+
  Bottom 0.406: v7.75,21.08 7.24,21.59 BYP.2 | v10.3,14.49 12.18,14.49 13.97,12.7 v13.97,10.67
VREG_EN  (via drill 0.3)
  Top 0.406: D1.C 15.62,15.11 15.68,15.18 | 15.68,15.18 v15.75,15.24 | R5.1 13.97,14.73 13.96,14.74 | U5.5 12.28,14.18 12.84,14.74 13.96,14.74 | 13.96,14.74 14.72,14.74 15.16,15.18 15.68,15.18
  Bottom 0.406: v15.75,15.24 16.1,15.6 JP6.2

### Text on the board
Bottom: v10
Measures: in | in | in | in | in | in
tDocu: Priyanka Makin